# EAGLE design ring-modulator (EAGLE 6.5.0)
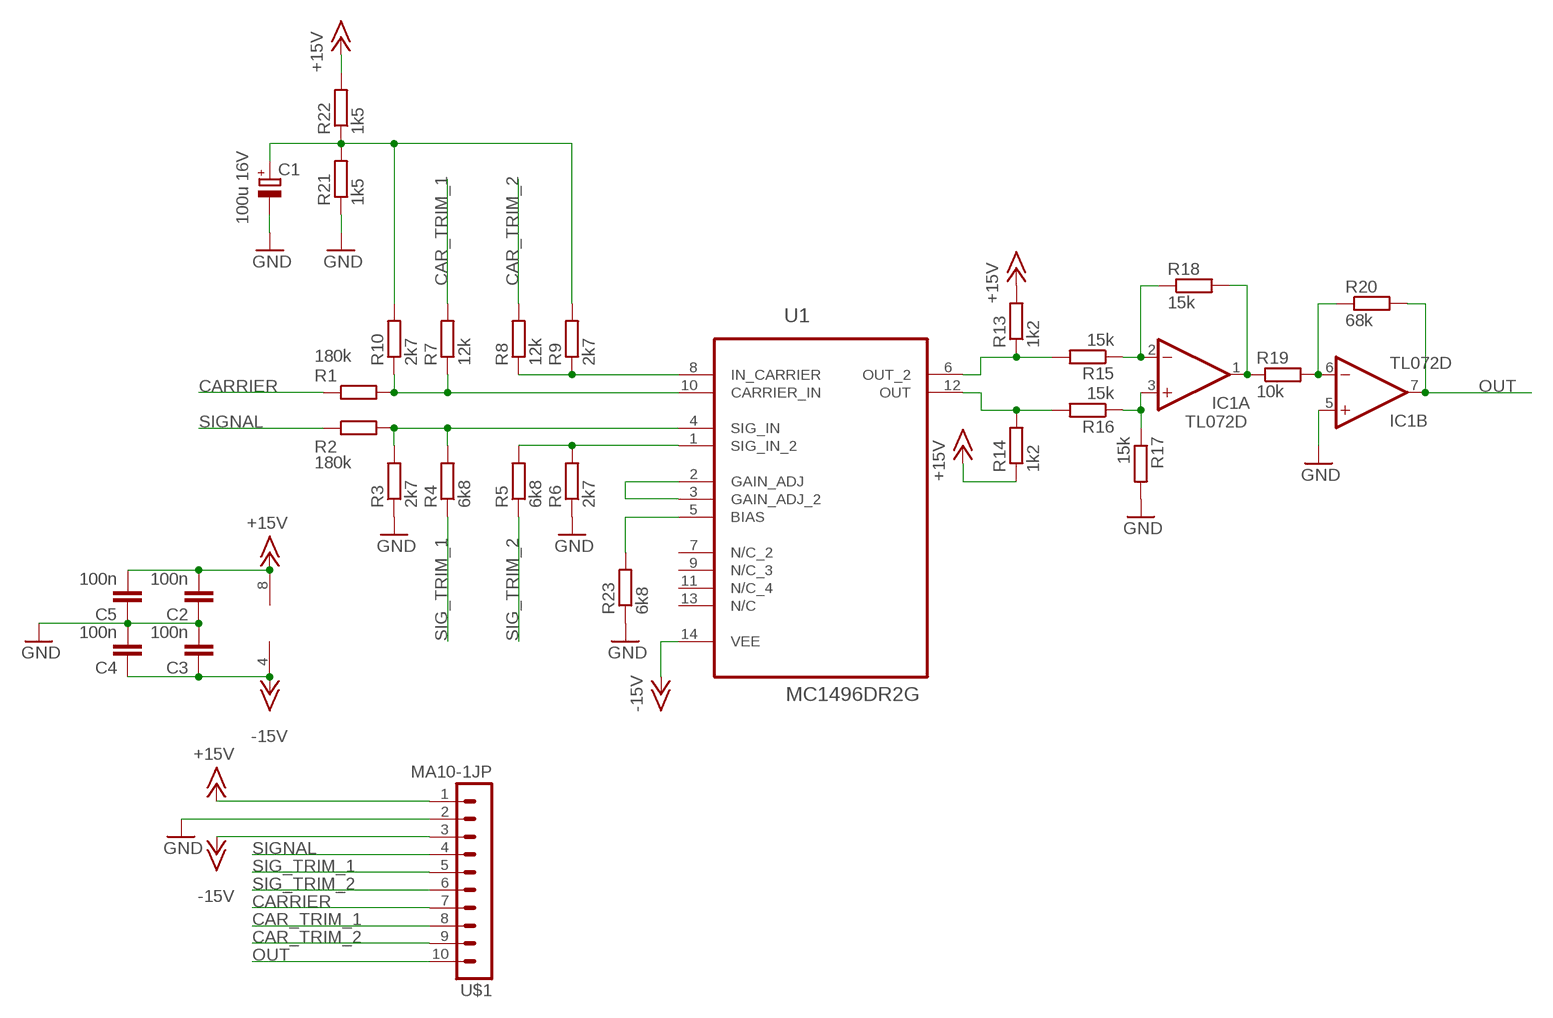
[diagram p0: schematic, sheet 1]

## Parts
C1  100u 16V  CPOL-EUE2.5-5  [E2,5-5]
C2  100n  C-EUC0805  [C0805]
C3  100n  C-EUC0805  [C0805]
C4  100n  C-EUC0805  [C0805]
C5  100n  C-EUC0805  [C0805]
IC1  TL072D  [SO08J]
R1  180k  R-EU_R0805  [R0805]
R2  180k  R-EU_R0805  [R0805]
R3  2k7  R-EU_R0805  [R0805]
R4  6k8  R-EU_R0805  [R0805]
R5  6k8  R-EU_R0805  [R0805]
R6  2k7  R-EU_R0805  [R0805]
R7  12k  R-EU_R0805  [R0805]
R8  12k  R-EU_R0805  [R0805]
R9  2k7  R-EU_R0805  [R0805]
R10  2k7  R-EU_R0805  [R0805]
R13  1k2  R-EU_R0805  [R0805]
R14  1k2  R-EU_R0805  [R0805]
R15  15k  R-EU_R0805  [R0805]
R16  15k  R-EU_R0805  [R0805]
R17  15k  R-EU_R0805  [R0805]
R18  15k  R-EU_R0805  [R0805]
R19  10k  R-EU_R0805  [R0805]
R20  68k  R-EU_R0805  [R0805]
R21  1k5  R-EU_R0805  [R0805]
R22  1k5  R-EU_R0805  [R0805]
R23  6k8  R-EU_R0805  [R0805]
U1  MC1496DR2G  [SOIC127P600X175-14N]
U$1  MA10-1JP  [SIP-PIN10-1J]

## Nets
+15V: C2.2 C5.2 IC1.8(P:V+) R13.2 R14.1 R22.2 U$1.1
-15V: C3.1 C4.1 IC1.4(P:V-) U1.14(VEE) U$1.3
CAR_TRIM_1: R7.2 U$1.8
CAR_TRIM_2: R8.2 U$1.9
CARRIER: R1.1 U$1.7
GND: C1.- C2.1 C3.2 C4.2 C5.1 IC1.5(B:+IN) R3.1 R6.1 R17.2 R21.1 R23.1 U$1.2
N$1: R2.2 R3.2 R4.2 U1.4(SIG_IN)
N$2: R1.2 R7.1 R10.1 U1.10(CARRIER_IN)
N$3: R5.2 R6.2 U1.1(SIG_IN_2)
N$8: R8.1 R9.1 U1.8(IN_CARRIER)
N$9: C1.+ R9.2 R10.2 R21.2 R22.1
N$11: R23.2 U1.5(BIAS)
N$12: U1.2(GAIN_ADJ) U1.3(GAIN_ADJ_2)
N$13: R13.1 R15.2 U1.6(OUT_2)
N$14: R14.2 R16.2 U1.12(OUT)
N$15: IC1.3(A:+IN) R16.1 R17.1
N$16: IC1.2(A:-IN) R15.1 R18.1
N$17: IC1.1(A:OUT) R18.2 R19.1
N$18: IC1.6(B:-IN) R19.2 R20.1
OUT: IC1.7(B:OUT) R20.2 U$1.10
SIG_TRIM_1: R4.1 U$1.5
SIG_TRIM_2: R5.1 U$1.6
SIGNAL: R2.1 U$1.4
Unconnected: U1.7(N/C_2) U1.9(N/C_3) U1.11(N/C_4) U1.13(N/C)

## Library data of the parts
C1 = resistor:CPOL-EU: POLARIZED CAPACITOR, European symbol
C2-C5 = resistor:C-EU: CAPACITOR, European symbol
IC1 = joakim:TL072: OP AMP
R1-R10 R13-R23 = resistor:R-EU_: RESISTOR, European symbol
U1 = ON Semiconductor_By_element14_Batch_1:MC1496DR2G: Balanced Modulators/Demodulators; MPN: MC1496DR2G; OC_FARNELL: 1651904; OC_NEWARK: 45J1148; PACKAGE: SOIC-14; SUPPLIER: ON SEMICONDUCTOR
U$1 = joakim:MA10-1J

## Board
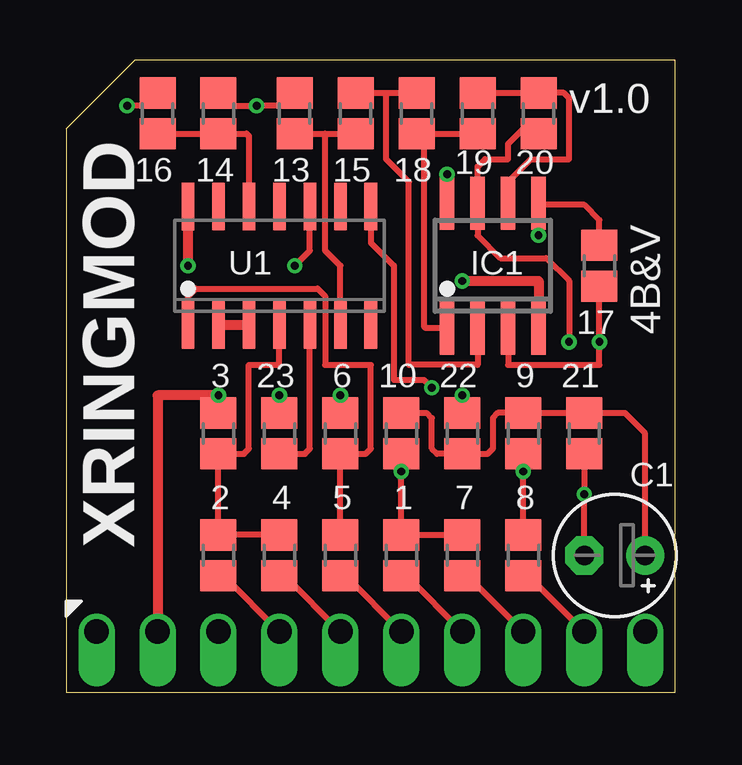
[diagram p1: board, top side]
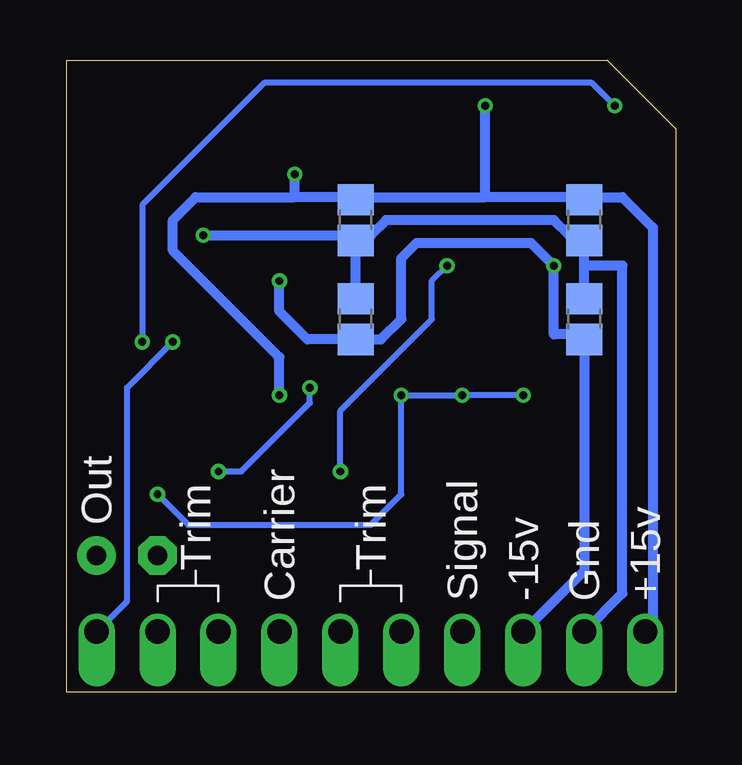
[diagram p2: board, bottom side, seen from below]

Size 25.38 x 26.35 mm. Coordinates in mm from the lower left corner, seen from the top.
Outline: 0,0 25.38,0 25.38,26.34 2.86,26.35 0,23.5 0,0
Copper layers (1*16): Top 0.035mm / dielectric 1.5mm / Bottom 0.035mm
Design rules "dirt_cheap_dirty_boards.v1": minimum track width 5mil, minimum drill 12mil, track to track 5mil, track to pad 5mil, pad to pad 5mil, via to via 5mil, smd to smd 0mil, copper to edge 10mil, drill to drill 10mil, minimum pad ring 10mil, minimum via ring 6mil, stop-mask expansion 2mil, vias tented up to drill 25mil, thermal gap 10mil

### Footprints (pad centres in the part's own frame; a part is rotated, then mirrored left to right if it is on the bottom)
E2,5-5 = drill 0.813 pad 1.6: + -1.27,0 | drill 0.813 pad 1.6 octagon: - 1.27,0
C0805 = smd 1.3 x 1.5: 1 -0.85,0; 2 0.85,0
SO08J = smd 0.6 x 2.2: 1 -1.905,-2.6; 2 -0.635,-2.6; 3 0.635,-2.6; 4 1.905,-2.6; 5 1.905,2.6; 6 0.635,2.6; 7 -0.635,2.6; 8 -1.905,2.6
R0805 = smd 1.3 x 1.5: 1 -0.85,0; 2 0.85,0
SOIC127P600X175-14N = smd 1.981 x 0.533: 1 -2.464,3.81; 2 -2.464,2.54; 3 -2.464,1.27; 4 -2.464,0; 5 -2.464,-1.27; 6 -2.464,-2.54; 7 -2.464,-3.81; 8 2.464,-3.81; 9 2.464,-2.54; 10 2.464,-1.27; 11 2.464,0; 12 2.464,1.27; 13 2.464,2.54; 14 2.464,3.81
SIP-PIN10-1J = drill 1.016 offset: 1 -11.43,0; 2 -8.89,0; 3 -6.35,0; 4 -3.81,0; 5 -1.27,0; 6 1.27,0; 7 3.81,0; 8 6.35,0; 9 8.89,0; 10 11.43,0

### Placement (x,y rotation side)
C1  22.86,5.71 180 top
C2  3.81,19.68 90 bottom
C3  3.81,15.56 90 bottom
C4  13.34,15.56 90 bottom
C5  13.34,19.68 90 bottom
IC1  17.78,17.78 0 top
R1  13.97,5.71 90 top
R2  6.35,5.71 90 top
R3  6.35,10.79 270 top
R4  8.89,5.71 90 top
R5  11.43,5.71 90 top
R6  11.43,10.79 270 top
R7  16.51,5.71 270 top
R8  19.05,5.71 270 top
R9  19.05,10.79 90 top
R10  13.97,10.79 90 top
R13  9.53,24.13 90 top
R14  6.35,24.13 270 top
R15  12.06,24.13 270 top
R16  3.81,24.13 270 top
R17  22.23,17.78 90 top
R18  14.61,24.13 270 top
R19  17.14,24.13 90 top
R20  19.68,24.13 270 top
R21  21.59,10.79 90 top
R22  16.51,10.79 90 top
R23  8.89,10.79 270 top
U1  8.89,17.78 90 top
U$1  12.7,2.54 0 top

### Tracks (layer width: path | path; a pad name or v marks a point on that pad's centre or on a via)
+15V  (via drill 0.33, 0.33 pad 0.25)
  Top 0.254: R14.1 6.35,24.45 v7.94,24.45 9.53,24.45 R13.2 | v16.51,12.38 R22.2
  Top 0.406: v15.88,21.59 IC1.8 15.88,19.68
  Bottom 0.406: U$1.1 0.95,2.86 0.95,19.37 2.22,20.64 3.81,20.64 | v16.51,12.38 16.51,13.97 20.95,18.41 20.95,19.68 20,20.64 15.88,20.64 | 13.34,20.64 7.94,20.64 | C2.2 3.81,20.64 | 3.81,20.64 7.94,20.64 | 7.94,20.64 v7.94,24.45 | C5.2 13.34,20.64 | 13.34,20.64 15.88,20.64 | 15.88,20.64 v15.88,21.59
-15V  (via drill 0.33)
  Top 0.406: v16.51,17.14 19.68,17.14 IC1.4 | v5.08,17.78 U1.14
  Bottom 0.406: v16.51,17.14 16.51,15.88 15.34,14.71 C4.1 12.28,14.71 11.43,15.56 11.43,18.1 10.79,18.73 6.03,18.73 v5.08,17.78 5.08,14.92 3.81,14.92 3.6,15.03 C3.1 3.81,5.08 U$1.3
CAR_TRIM_1
  Top 0.254: R7.2 16.73,4.87 U$1.8
CAR_TRIM_2
  Top 0.254: R8.2 19.27,4.87 U$1.9
CARRIER
  Top 0.254: R1.1 14.19,4.87 U$1.7
GND  (via drill 0.33)
  Top 0.254: R6.1 v11.43,12.38 | v8.89,12.38 R23.1 | R21.1 v21.59,8.26 C1.- | R17.2 22.23,19.68 21.59,20.32 19.75,20.32 IC1.5 v19.68,19.05
  Top 0.406: U$1.2 3.81,12.38 v6.35,12.38 R3.1
  Bottom 0.254: v6.35,12.38 v8.89,12.38 v11.43,12.38 11.43,8.26 12.7,6.99 20.32,6.99 v21.59,8.26 | 13.76,18.41 C5.1
  Bottom 0.406: C4.2 C5.1 | C3.2 3.81,17.78 | 3.81,17.78 C2.1 3.81,19.05 4.45,19.05 5.08,19.68 12.06,19.68 12.7,19.05 13.34,19.05 C5.1 | U$1.2 2.22,4.13 2.22,17.78 3.81,17.78 | v19.68,19.05 13.55,19.05 C5.1
N$1
  Top 0.254: R4.2 R2.2 R3.2 7.41,9.95 7.62,10.16 7.62,13.65 8.89,13.65 U1.4
N$2  (via drill 0.33)
  Top 0.254: R7.1 R1.2 v13.97,9.21 R10.1 | v9.53,17.78 10.16,18.41 U1.10
  Bottom 0.254: v13.97,9.21 13.97,11.75 10.16,15.56 10.16,17.14 v9.53,17.78
N$3
  Top 0.254: R5.2 R6.2 12.48,9.95 12.7,10.16 12.7,13.65 10.79,13.65 10.79,16.51 10.48,16.83 5.4,16.83 5.08,16.51 U1.1
N$8  (via drill 0.33)
  Top 0.254: U1.8 12.7,18.73 13.65,17.78 13.65,13.02 14.92,13.02 v15.24,12.7 | R8.1 v19.05,9.21 R9.1
  Bottom 0.254: v19.05,9.21 18.1,9.21 15.24,12.06 v15.24,12.7
N$9
  Top 0.254: R10.2 15.03,11.64 15.24,11.43 15.24,10.16 15.46,9.95 R22.1 17.57,9.95 17.78,10.16 17.78,11.43 18,11.64 R9.2 R21.2 23.28,11.64 24.13,10.79 C1.+
N$11
  Top 0.254: R23.2 9.95,9.95 10.16,10.16 U1.5
N$12
  Top 0.406: U1.2 U1.3
N$13
  Top 0.254: U1.6 11.43,17.78 10.79,18.41 10.79,23.28 | R13.1 10.79,23.28 | 10.79,23.28 R15.2
N$14
  Top 0.254: R16.2 R14.2 7.52,23.28 7.62,23.18 U1.12
N$15  (via drill 0.33)
  Top 0.254: 22.44,17.14 R17.1 v22.23,14.61 22.23,13.65 18.41,13.65 IC1.3 | R16.1 3.81,24.45 v2.54,24.45
  Bottom 0.254: v2.54,24.45 3.49,25.4 17.14,25.4 22.23,20.32 v22.23,14.61
N$16
  Top 0.254: R15.1 13.34,24.98 | 13.34,24.98 R18.1 | IC1.2 17.14,13.65 14.29,13.65 14.29,21.27 13.34,22.23 13.34,24.98
N$17
  Top 0.254: R19.1 R18.2 14.61,23.18 14.92,22.86 14.92,15.24 14.98,15.18 IC1.1
N$18
  Top 0.254: R19.2 R20.1 20.74,24.98 20.95,24.77 20.95,22.23 19.37,22.23 18.41,21.27 IC1.6
OUT  (via drill 0.33)
  Top 0.254: v20.95,14.61 20.95,17.14 20,18.1 18.1,18.1 17.14,19.05 IC1.7 17.14,21.91 17.46,22.23 18.41,22.23 18.41,22.86 19.05,23.5 R20.2
  Bottom 0.254: U$1.10 22.86,3.81 22.86,12.7 v20.95,14.61
SIG_TRIM_1
  Top 0.254: R4.1 9.11,4.87 U$1.5
SIG_TRIM_2
  Top 0.254: R5.1 11.64,4.87 U$1.6
SIGNAL
  Top 0.254: R2.1 6.57,4.87 U$1.4

### Text on the board
tNames: v1.0 | 19 | 20 | 16 | 14 | 13 | 15 | 18 | U1 | IC1 | 17 | 4B&V | 3 | 23 | 6 | 10 | 22 | 9 | 21 | C1 | 2 | 4 | 5 | 1 | 7 | 8 | XRINGMOD
bNames: Out | Trim | Trim | +15v | Gnd | -15v | Signal | Carrier